# Altium project SignalBufferBoard.PrjPcb
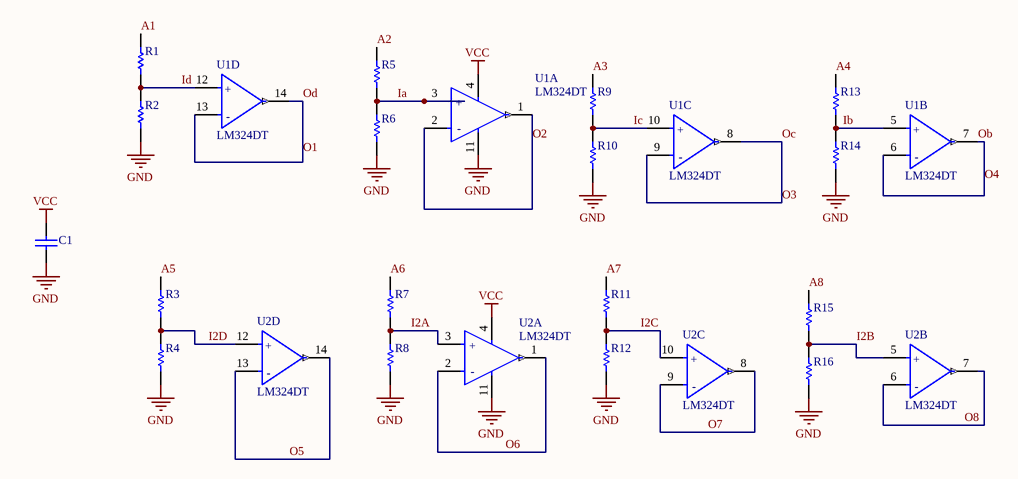
[diagram p0: SignalBufferBoard.SchDoc]
1 sheet, 19 parts. Net scope: global (net labels, ports and power ports of the same name join across sheets).
Board file: SignalBufferBoard.PcbDoc

## Sheet SignalBufferBoard.SchDoc
size A; SheetNumber: 1; SheetTotal: 1

### Parts
C1  C0805C105K4PACTU  [CAPC2013X145X50NL20T25]  (value not drawn)
R1  ERA6AEB104V  [RESC2013X60X40ML20T25]  (value not drawn)
R2  ERA6AEB204V  [RESC2013X60X40ML20T25]  (value not drawn)
R3  ERA6AEB104V  [RESC2013X60X40ML20T25]  (value not drawn)
R4  ERA6AEB204V  [RESC2013X60X40ML20T25]  (value not drawn)
R5  ERA6AEB104V  [RESC2013X60X40ML20T25]  (value not drawn)
R6  ERA6AEB204V  [RESC2013X60X40ML20T25]  (value not drawn)
R7  ERA6AEB104V  [RESC2013X60X40ML20T25]  (value not drawn)
R8  ERA6AEB204V  [RESC2013X60X40ML20T25]  (value not drawn)
R9  ERA6AEB104V  [RESC2013X60X40ML20T25]  (value not drawn)
R10  ERA6AEB204V  [RESC2013X60X40ML20T25]  (value not drawn)
R11  ERA6AEB104V  [RESC2013X60X40ML20T25]  (value not drawn)
R12  ERA6AEB204V  [RESC2013X60X40ML20T25]  (value not drawn)
R13  ERA6AEB104V  [RESC2013X60X40ML20T25]  (value not drawn)
R14  ERA6AEB204V  [RESC2013X60X40ML20T25]  (value not drawn)
R15  ERA6AEB104V  [RESC2013X60X40ML20T25]  (value not drawn)
R16  ERA6AEB204V  [RESC2013X60X40ML20T25]  (value not drawn)
U1  LM324DT  [FP-SO-14-IPC_A]  (parts A,B,C,D of 4)
U2  LM324DT  [FP-SO-14-IPC_A]  (parts A,B,C,D of 4)

### Nets
GND: C1.1 R2.1 R4.1 R6.1 R8.1 R10.1 R12.1 R14.1 R16.1 U1.11(VCC-) U2.11(VCC-)
VCC: C1.2 U1.4(VCC+) U2.4(VCC+)
A1: R1.2
A2: R5.2
A3: R9.2
A4: R13.2
A5: R3.2
A6: R7.2
A7: R11.2
A8: R15.2
I2A: R7.1 R8.2 U2.3(Non-Inverting_Input_1)
I2B: R15.1 R16.2 U2.5(Non-Inverting_Input_2)
I2C: R11.1 R12.2 U2.10(Non-Inverting_Input_3)
I2D: R3.1 R4.2 U2.12(Non-Inverting_Input_4)
Ia: R5.1 R6.2 U1.3(Non-Inverting_Input_1)
Ib: R13.1 R14.2 U1.5(Non-Inverting_Input_2)
Ic: R9.1 R10.2 U1.10(Non-Inverting_Input_3)
Id: R1.1 R2.2 U1.12(Non-Inverting_Input_4)
O1: U1.13(Inverting_Input_4) U1.14(Output_4)  [also labelled Od]
O2: U1.1(Output_1) U1.2(Inverting_Input_1)
O3: U1.8(Output_3) U1.9(Inverting_Input_3)  [also labelled Oc]
O4: U1.6(Inverting_Input_2) U1.7(Output_2)  [also labelled Ob]
O5: U2.13(Inverting_Input_4) U2.14(Output_4)
O6: U2.1(Output_1) U2.2(Inverting_Input_1)
O7: U2.8(Output_3) U2.9(Inverting_Input_3)
O8: U2.6(Inverting_Input_2) U2.7(Output_2)

### Notes on the sheet
- (in symbol CMP-12131-000005-1, part A) +; -
- (in symbol CMP-12131-000005-1, part B) +; -
- (in symbol CMP-12131-000005-1, part C) +; -
- (in symbol CMP-12131-000005-1, part D) +; -

### Library data of the parts
C1 = CMP-1036-04746-2: Manufacturer: Kemet; Part Number: C0805C105K4PACTU
R1 R3 R5 R7 R9 R11 R13 R15 = CMP-2001-00583-1: Manufacturer: Panasonic; Part Number: ERA6AEB104V
R2 R4 R6 R8 R10 R12 R14 R16 = CMP-2001-00611-1: Manufacturer: Panasonic; Part Number: ERA6AEB204V
U1 U2 = CMP-12131-000005-1: IC OPAMP GP 4 CIRCUIT 14SO; Manufacturer: STMicroelectronics; Voltage Gain: 100dB; Standoff Height: 0.1mm; Bandwidth: 1.3MHz; Max Junction Temp: +150°C; Min Supply Voltage: 3V; Max Dual Supply Voltage: 15V; Min Dual Supply Voltage: 1.5V; Number Of Channels: 4; Nominal Supply Current: 0.7-1.5mA; Output Current Per Channel: 20-50mA; Max Supply Voltage: 30V; Input Offset Voltage: 2mV; Input Bias Current: 0.02uA; Device Class L1: Integrated Circuits (ICs); Device Class L3: Amplifiers - Op Amps; Temperature Range Low: 0°C; Package: SO-14; Temperature Range High: +70°C; Digikey Description: IC OPAMP GP 4 CIRCUIT 14SO; Device Class L2: Linear ICs; Footprint Url: https://www.st.com/content/ccc/resource/technical/document/datasheet/group3/10/8a/e6/12/f8/e8/49/ce/DM00366438/files/DM00366438.pdf/jcr:content/translations/en.DM00366438.pdf; Octopart: https://octopart.com/lm324dt-stmicroelectronics-39579146; ComponentLink2URL: https://www.st.com/content/ccc/resource/technical/document/datasheet/bd/fc/46/43/26/8f/40/7f/CD00001046.pdf/files/CD00001046.pdf/jcr:content/translations/en.CD00001046.pdf; ComponentLink2Description: Datasheet; Lead Free: Yes; Temperature: 0°C to +70°C; RoHS: TRUE; Gain Bandwidth: 1.3MHz; Manufacturer Part Number: LM324DT; Automotive: No; Category: IC; Height: 1.75mm; Mouser Description: LM324 Series 32 V 1.3 MHz Low Power Quad Operational Amplifier - SOIC-14